# EasyEDA Pro project HandyPico.epro, schematic Schematic1
Board Name: Board1; Create Date: 2025-08-05; Page Name: Main; Project Name: HandyPico; Schematic Name: Schematic1; Update Date: 2025-08-15; Company: EasyEDA.com; Page Size: A3; Version: V1.0
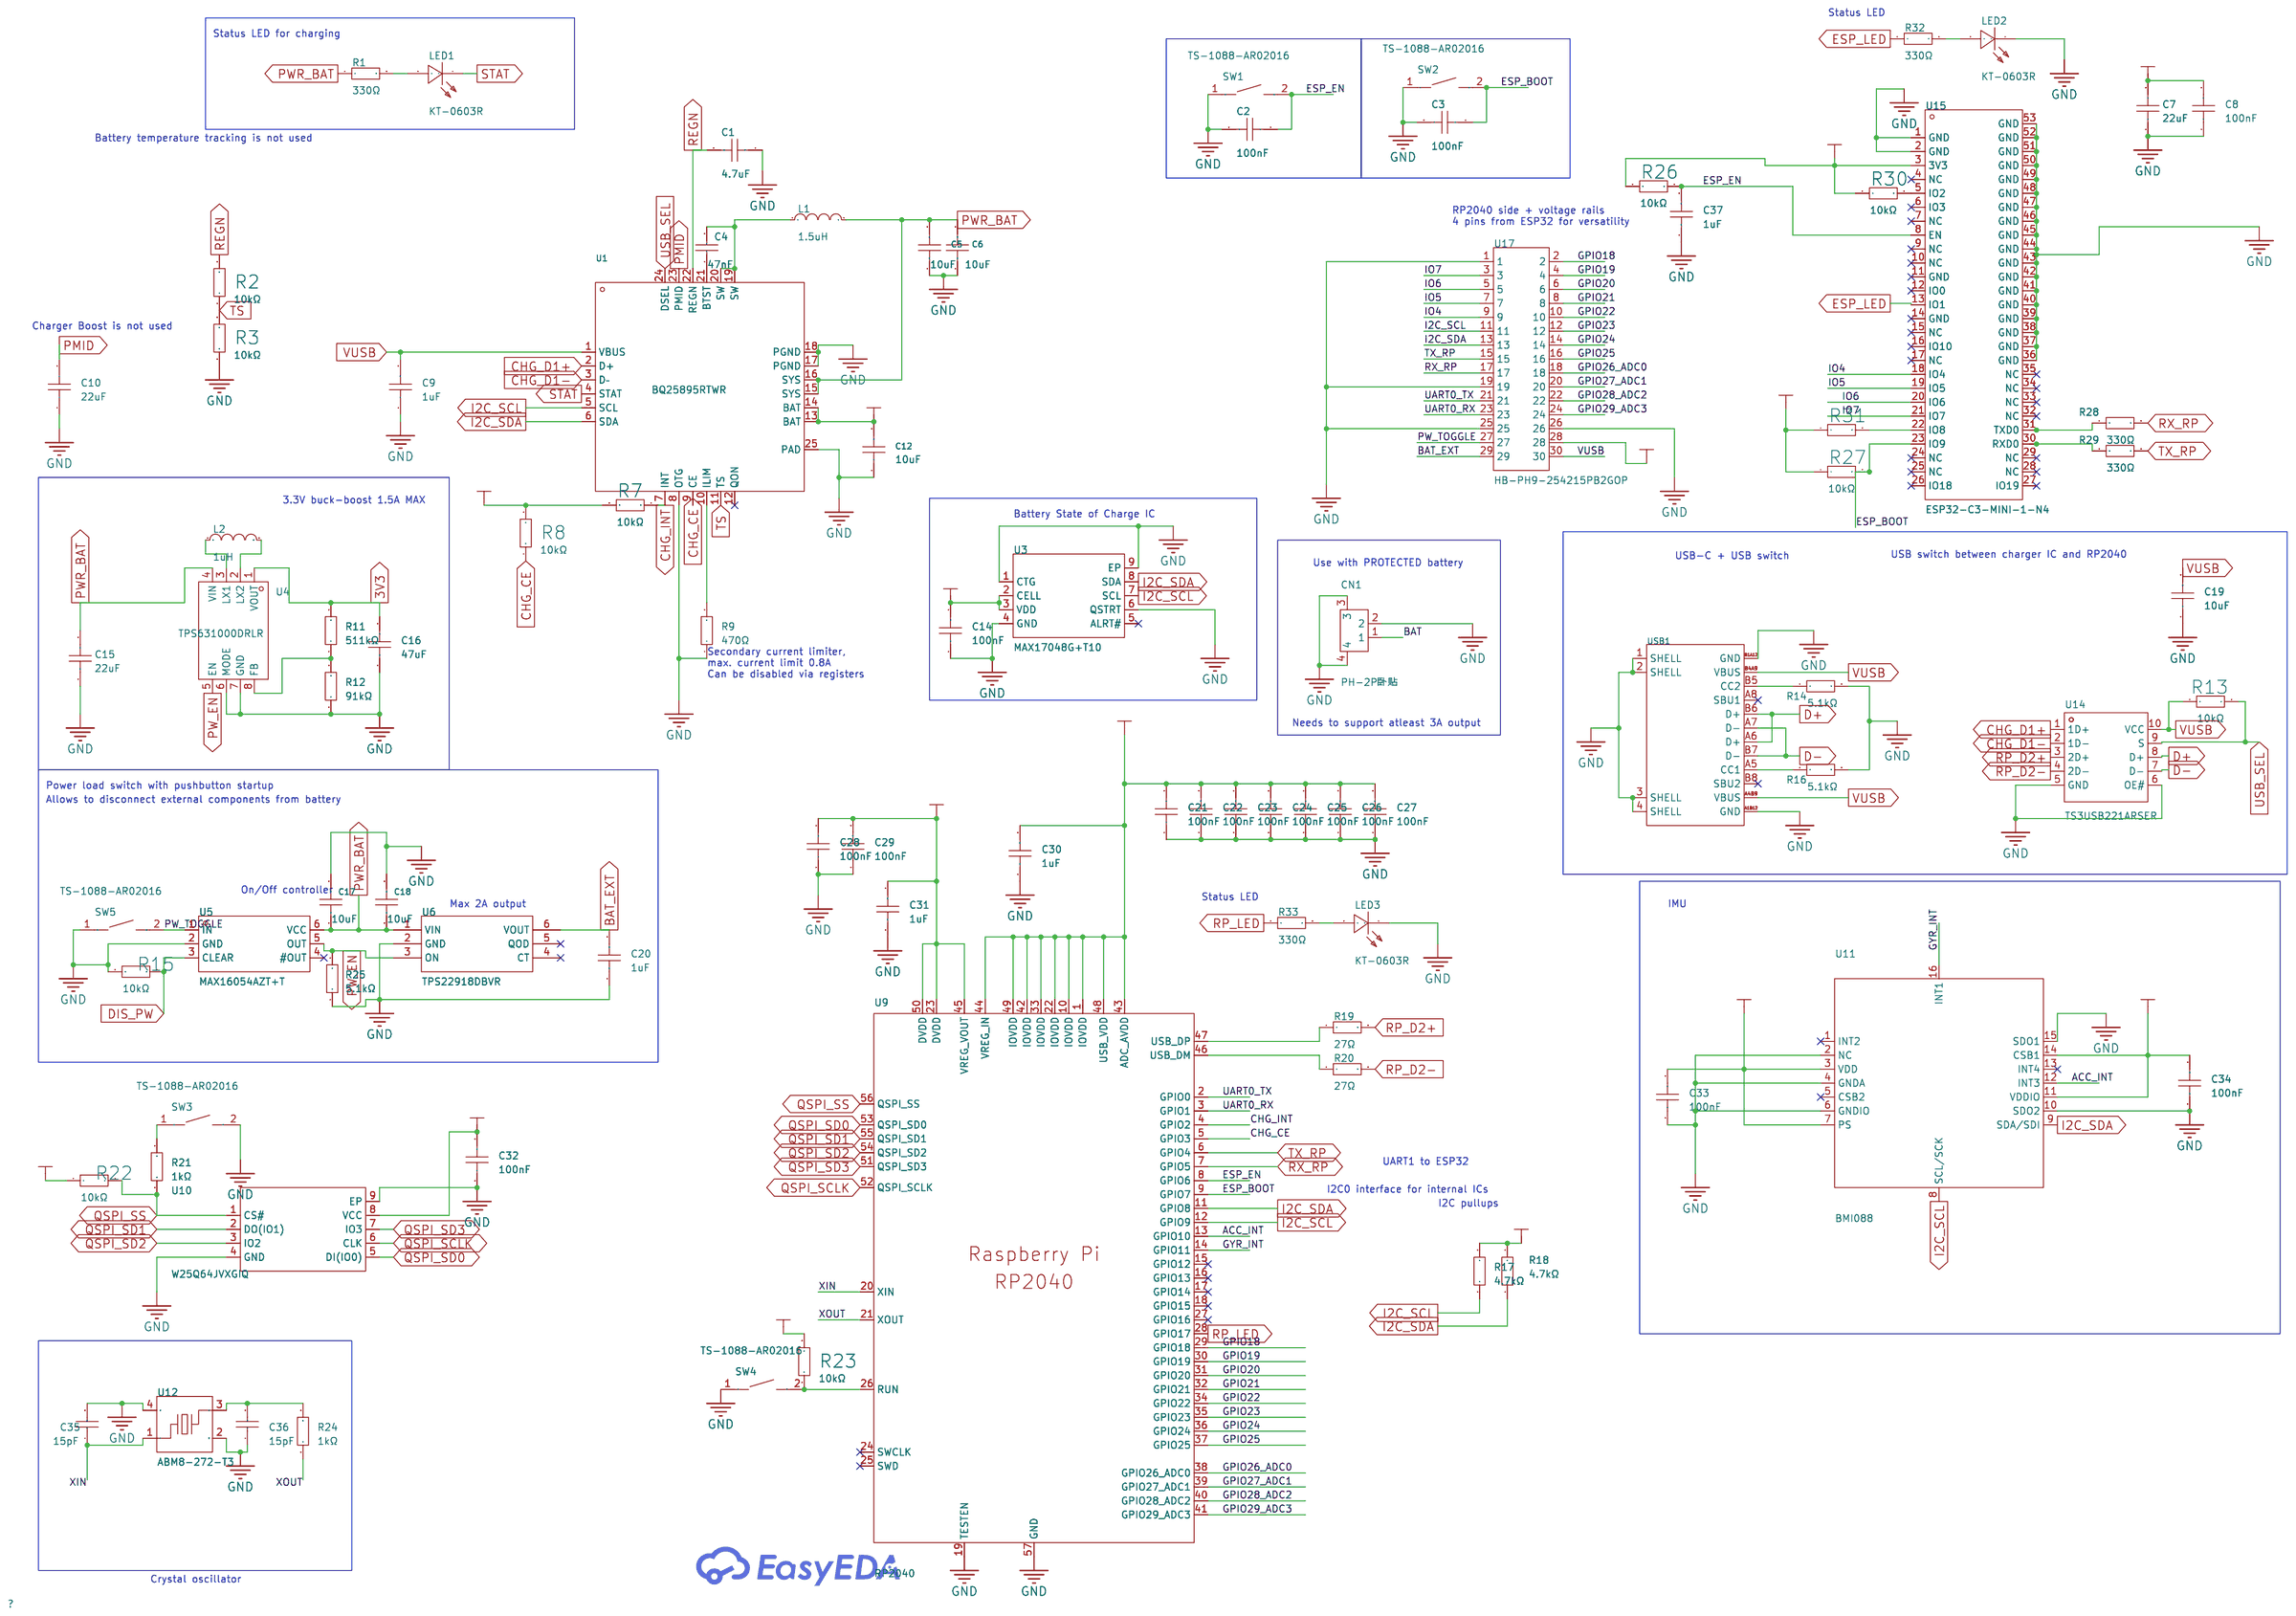
[diagram p0: schematic sheet]

## Parts
C1  4.7uF  [C0402]
C2  100nF  [C0402]
C3  100nF  [C0402]
C4  47nF  [C0603]
C5  10uF  [C0603]
C6  10uF  [C0603]
C7  22uF  [C0603]
C8  100nF  [C0402]
C9  1uF  [C0603]
C10  22uF  [C0603]
C12  10uF  [C0603]
C14  100nF  [C0402]
C15  22uF  [C0603]
C16  47uF  [C0603]
C17  10uF  [C0603]
C18  10uF  [C0603]
C19  10uF  [C0603]
C20  1uF  [C0603]
C21  100nF  [C0402]
C22  100nF  [C0402]
C23  100nF  [C0402]
C24  100nF  [C0402]
C25  100nF  [C0402]
C26  100nF  [C0402]
C27  100nF  [C0402]
C28  100nF  [C0402]
C29  100nF  [C0402]
C30  1uF  [C0402]
C31  1uF  [C0402]
C32  100nF  [C0402]
C33  100nF  [C0402]
C34  100nF  [C0402]
C35  15pF  [C0603]
C36  15pF  [C0603]
C37  1uF  [C0402]
CN1  PH-2P卧贴  [CONN-SMD_2P-P2.00_PH2.0-SPWB]
L1  1.5uH  [IND-SMD_L4.4-W4.2]
L2  1uH  [L1008]
LED1  KT-0603R  [LED0603-RD]
LED2  KT-0603R  [LED0603-RD]
LED3  KT-0603R  [LED0603-RD]
R1  330Ω  [R0402]
R2  10kΩ  [R0402]
R3  10kΩ  [R0402]
R7  10kΩ  [R0402]
R8  10kΩ  [R0402]
R9  470Ω  [R0402]
R11  511kΩ  [R0402]
R12  91kΩ  [R0402]
R13  10kΩ  [R0402]
R14  5.1kΩ  [R0402]
R15  10kΩ  [R0402]
R16  5.1kΩ  [R0402]
R17  4.7kΩ  [R0402]
R18  4.7kΩ  [R0402]
R19  27Ω  [R0603]
R20  27Ω  [R0603]
R21  1kΩ  [R0402]
R22  10kΩ  [R0402]
R23  10kΩ  [R0402]
R24  1kΩ  [R0402]
R25  5.1kΩ  [R0402]
R26  10kΩ  [R0402]
R27  10kΩ  [R0402]
R28  330Ω  [R0402]
R29  330Ω  [R0402]
R30  10kΩ  [R0402]
R31  10kΩ  [R0402]
R32  330Ω  [R0402]
R33  330Ω  [R0402]
SW1  TS-1088-AR02016  [SW-SMD_L3.9-W3.0-P4.45]
SW2  TS-1088-AR02016  [SW-SMD_L3.9-W3.0-P4.45]
SW3  TS-1088-AR02016  [SW-SMD_L3.9-W3.0-P4.45]
SW4  TS-1088-AR02016  [SW-SMD_L3.9-W3.0-P4.45]
SW5  TS-1088-AR02016  [SW-SMD_L3.9-W3.0-P4.45]
U1  BQ25895RTWR  [QFN-24_L4.0-W4.0-P0.50-TL-EP2.7]
U3  MAX17048G+T10  [TDFN-8_L2.0-W2.0-P0.50-BL-EP1.2]
U4  TPS631000DRLR  [SOT-583-8_L2.1-W1.2-P0.50-LS1.6-BL]
U5  MAX16054AZT+T  [TSOT-23-6_L2.9-W1.6-P0.95-LS2.8-TL]
U6  TPS22918DBVR  [SOT-23-6_L2.9-W1.6-P0.95-LS2.8-BR]
U9  RP2040  [LQFN-56_L7.0-W7.0-P0.4-EP]
U10  W25Q64JVXGIQ  [XSON-8_L4.0-W4.0-P0.80-TL-EP]
U11  BMI088  [LGA-16_L4.5-W3.0-P0.50-BL]
U12  ABM8-272-T3  [CRYSTAL-SMD_4P-L3.2-W2.5-BL]
U14  TS3USB221ARSER  [UQFN-10_L2.0-W1.5-P0.50-BL]
U15  ESP32-C3-MINI-1-N4  [WIFIM-SMD_ESP32-C3-MINI-1]
U17  HB-PH9-254215PB2GOP  [HDR-SMD_30P-P2.54-V-M-R2-C15-S7.4]
USB1  HC-TYPE-C-16P-01A-R  [USB-C-SMD_G-SWITCH_GT-USB-7010EN]

## Library data of the parts
C1 = CL05A475MP5NRNC: Capacitance: Tolerance:±20% Tolerance:±20% Voltage Rated: Temperature Coefficient:; LCSC Part Name: 4.7uF ±20% 10V; Supplier Part: C23733; Manufacturer: SAMSUNG(三星); Supplier Footprint: 0402; JLCPCB Part Class: Basic Part; Datasheet: https://atta.szlcsc.com/upload/public/pdf/source/20160218/1457707763339.pdf; Supplier: LCSC; Tolerance: ±20%
C2 C3 C8 C14 C21-C29 C32-C34 = CL05B104KO5NNNC: Capacitance: Tolerance:±10% Tolerance:±10% Voltage Rated: Temperature Coefficient:; LCSC Part Name: 100nF ±10% 16V; Supplier Part: C1525; Manufacturer: SAMSUNG(三星); Supplier Footprint: 0402; JLCPCB Part Class: Basic Part; Datasheet: https://atta.szlcsc.com/upload/public/pdf/source/20160218/1457707763339.pdf; Supplier: LCSC; Tolerance: ±10%
C4 = CL10B473KB8NNNC: Capacitance: Tolerance:±10% Tolerance:±10% Voltage Rated: Temperature Coefficient:; LCSC Part Name: 47nF ±10% 50V; Supplier Part: C1622; Manufacturer: SAMSUNG(三星); Supplier Footprint: 0603; JLCPCB Part Class: Basic Part; Datasheet: https://atta.szlcsc.com/upload/public/pdf/source/20160218/1457707763339.pdf; Supplier: LCSC; Tolerance: ±10%
C5 C6 C12 C17 C18 = CL10A106MA8NRNC: Capacitance: Tolerance:±20% Tolerance:±20% Voltage Rated: Temperature Coefficient:; LCSC Part Name: 10uF ±20% 25V; Supplier Part: C96446; Manufacturer: SAMSUNG(三星); Supplier Footprint: 0603; JLCPCB Part Class: Basic Part; Datasheet: https://atta.szlcsc.com/upload/public/pdf/source/20160218/1457707763339.pdf; Supplier: LCSC; Tolerance: ±20%
C7 C15 = GRM187R61A226ME15D: Capacitance: Tolerance:±20% Tolerance:±20% Voltage Rated: Temperature Coefficient:; LCSC Part Name: 22uF ±20% 10V; Supplier Part: C361061; Manufacturer: muRata(村田); Supplier Footprint: 0603; JLCPCB Part Class: Extended Part; Datasheet: https://atta.szlcsc.com/upload/public/pdf/source/20230811/0F3D1898722F297D9C38FFBA21B94C23.pdf; Supplier: LCSC; Tolerance: ±20%
C9 C20 = CL10A105KB8NNNC: Capacitance: Tolerance:±10% Tolerance:±10% Voltage Rated: Temperature Coefficient:; LCSC Part Name: 1uF ±10% 50V; Supplier Part: C15849; Manufacturer: SAMSUNG(三星); Supplier Footprint: 0603; JLCPCB Part Class: Basic Part; Datasheet: https://atta.szlcsc.com/upload/public/pdf/source/20160218/1457707763339.pdf; Supplier: LCSC; Tolerance: ±10%
C10 = CL10A226MQ8NRNC: Capacitance: Tolerance:±20% Tolerance:±20% Voltage Rated: Temperature Coefficient:; LCSC Part Name: 22uF ±20% 6.3V; Supplier Part: C59461; Manufacturer: SAMSUNG(三星); Supplier Footprint: 0603; JLCPCB Part Class: Basic Part; Datasheet: https://atta.szlcsc.com/upload/public/pdf/source/20160218/1457707763339.pdf; Supplier: LCSC; Tolerance: ±20%
C16 = CL10A476MQ8QRNC: Capacitance: Tolerance:±20% Tolerance:±20% Voltage Rated: Temperature Coefficient:; LCSC Part Name: 47uF ±20% 6.3V; Supplier Part: C730416; Manufacturer: SAMSUNG(三星); Supplier Footprint: 0603; JLCPCB Part Class: Extended Part; Datasheet: https://atta.szlcsc.com/upload/public/pdf/source/20160218/1457707763339.pdf; Supplier: LCSC; Tolerance: ±20%
C19 = CL10A106KP8NNNC: Capacitance: Tolerance:±10% Tolerance:±10% Voltage Rated: Temperature Coefficient:; LCSC Part Name: 10uF ±10% 10V; Supplier Part: C19702; Manufacturer: SAMSUNG(三星); Supplier Footprint: 0603; JLCPCB Part Class: Basic Part; Datasheet: https://atta.szlcsc.com/upload/public/pdf/source/20160218/1457707763339.pdf; Supplier: LCSC; Tolerance: ±10%
C30 C31 C37 = CL05A105KA5NQNC: Capacitance:1uF Tolerance:±10% Tolerance:±10% Voltage Rating:25V Temperature Coefficient:X5R; LCSC Part Name: 1uF ±10% 25V; Supplier Part: C52923; Manufacturer: SAMSUNG(三星); Supplier Footprint: 0402; JLCPCB Part Class: Basic Part; Datasheet: https://item.szlcsc.com/datasheet/CL05A105KA5NQNC/53938.html; Supplier: LCSC; Tolerance: ±10%; Voltage Rating: 25V; Temperature Coefficient: X5R
C35 C36 = CL10C150JB8NNNC: Capacitance: Tolerance:±5% Tolerance:±5% Voltage Rated: Temperature Coefficient:; LCSC Part Name: 15pF ±5% 50V; Supplier Part: C1644; Manufacturer: SAMSUNG(三星); Supplier Footprint: 0603; JLCPCB Part Class: Basic Part; Datasheet: https://atta.szlcsc.com/upload/public/pdf/source/20160218/1457707763339.pdf; Supplier: LCSC; Tolerance: ±5%
CN1 = PH-2P卧贴: Pins Structure:1x2P Pitch:2mm Mounting Type:Horizontal attachment Reference Series:PH Number of Pins:2P Number of Rows:1 Number of PINs Per Row:2 Row Spacing:- Current Rating:- Contact Material:- Contact Plating:- Operating Temperature:- Operating Tempera; LCSC Part Name: 1x2P 间距:2mm 卧贴 系列:PH; Supplier Part: C47647; Manufacturer: BOOMELE(博穆精密); Supplier Footprint: SMD,P=2mm; JLCPCB Part Class: Extended Part; Datasheet: https://atta.szlcsc.com/upload/public/pdf/source/20190102/C47647_9D4529A62A880BCB90F7648666ABEA31.pdf; Supplier: LCSC; Pins Structure: 1x2P; Pitch: 2mm; Mounting Type: Horizontal attachment; Reference Series: PH; Number of Pins: 2P; Number of Rows: 1; Number of PINs Per Row: 2
L1 = FXL0420-1R5-M: Inductance: Tolerance:±20% Tolerance:±20% Rated Current: Saturation Current (Isat):6A DC Resistance (DCR): Type:Integrated molded inductor; LCSC Part Name: 1.5uH ±20% 6A; Supplier Part: C167205; Manufacturer: cjiang(长江微电); Supplier Footprint: SMD,4.2x4.4mm; JLCPCB Part Class: Extended Part; Datasheet: https://atta.szlcsc.com/upload/public/pdf/source/20240426/3189EA8206330E2108542F9E34E540E7.pdf; Supplier: LCSC; Tolerance: ±20%; Saturation Current (Isat): 6A; Type: Integrated molded inductor
L2 = DFE252012P-1R0M=P2: Inductance:1uH Tolerance:±20% Tolerance:±20% Current Rating:4.3A Current - Saturation(Isat):4.3A DC Resistance(DCR):42mΩ Type:- Ratings:-; LCSC Part Name: 1uH ±20% 4.3A; Supplier Part: C882955; Manufacturer: muRata(村田); Supplier Footprint: 1008; JLCPCB Part Class: Extended Part; Datasheet: https://atta.szlcsc.com/upload/public/pdf/source/20201020/C882955_448D34C20C76D68776F8F2692B40A653.pdf; Supplier: LCSC; Tolerance: ±20%; Current Rating: 4.3A; Current - Saturation(Isat): 4.3A; DC Resistance(DCR): 42mΩ
LED1-LED3 = KT-0603R: Emitted Color:Red Power Dissipation:- Forward Current:- Dominant Wavelength:- Dominant Wavelength:- Peak Wavelength:- Diode Configuration:- Lens Color:- Color Temperature:- Color Temperature:- Viewing Angle:- Mounting Sytle:- Operating Temperature:-40℃~+8; LCSC Part Name: 0603 红灯 高亮; Supplier Part: C2286; Manufacturer: KENTO; Supplier Footprint: 0603; JLCPCB Part Class: Basic Part; Datasheet: https://atta.szlcsc.com/upload/public/pdf/source/20160616/1466072038404.pdf; Supplier: LCSC; Emitted Color: Red; Operating Temperature: -40℃~+85℃
R1 R32 R33 = 0402WGF3300TCE: Type:Thick Film Resistors Resistance:330Ω Tolerance:±1% Tolerance:±1% Power(Watts):1/16W Voltage-Supply(Max):50V Temperature Coefficient:±100ppm/℃ Temperature Coefficient:±100ppm/℃ Operating Temperature:-55℃~+155℃ Operating Temperature:-55℃~+155℃; LCSC Part Name: 330Ω ±1% 62.5mW 厚膜电阻; Supplier Part: C25104; Manufacturer: UNI-ROYAL(厚声); Supplier Footprint: 0402; JLCPCB Part Class: Basic Part; Datasheet: https://item.szlcsc.com/datasheet/0402WGF3300TCE/25847.html; Supplier: LCSC; Type: Thick Film Resistors; Tolerance: ±1%; Power(Watts): 1/16W; Voltage-Supply(Max): 50V; Temperature Coefficient: ±100ppm/℃; Operating Temperature: -55℃~+155℃
R2 R3 R7 R8 R13 R15 R22 R23 R26 R27 R30 R31 = 0402WGF1002TCE: Type:Thick Film Resistors Resistance:10kΩ Tolerance:±1% Tolerance:±1% Power(Watts): Overload Voltage (Max): Temperature Coefficient:±100ppm/℃ Temperature Coefficient:±100ppm/℃ Operating Temperature Range:-55℃~+155℃ Operating Temperature Range:-55℃~+155℃; LCSC Part Name: 10kΩ ±1% 62.5mW 厚膜电阻; Supplier Part: C25744; Manufacturer: UNI-ROYAL(厚声); Supplier Footprint: 0402; JLCPCB Part Class: Basic Part; Datasheet: https://atta.szlcsc.com/upload/public/pdf/source/20200306/C422600_1E6D84923E4A46A82E41ADD87F860B5C.pdf; Supplier: LCSC; Type: Thick Film Resistors; Tolerance: ±1%; Temperature Coefficient: ±100ppm/℃; Operating Temperature Range: -55℃~+155℃
R9 = 0402WGF4700TCE: Type:Thick Film Resistors Resistance: Tolerance:±1% Tolerance:±1% Power(Watts): Overload Voltage (Max): Temperature Coefficient:±100ppm/℃ Temperature Coefficient:±100ppm/℃ Operating Temperature Range:-55℃~+155℃ Operating Temperature Range:-55℃~+155℃; LCSC Part Name: 470Ω ±1% 62.5mW 厚膜电阻; Supplier Part: C25117; Manufacturer: UNI-ROYAL(厚声); Supplier Footprint: 0402; JLCPCB Part Class: Basic Part; Datasheet: https://atta.szlcsc.com/upload/public/pdf/source/20200306/C422600_1E6D84923E4A46A82E41ADD87F860B5C.pdf; Supplier: LCSC; Type: Thick Film Resistors; Tolerance: ±1%; Temperature Coefficient: ±100ppm/℃; Operating Temperature Range: -55℃~+155℃
R11 = 0402WGF5113TCE: Type:Thick Film Resistor Resistance:511kΩ Tolerance:±1% Tolerance:±1% Power(Watts):62.5mW Voltage-Supply(Max):50V Temperature Coefficient:±100ppm/℃ Temperature Coefficient:±100ppm/℃ Operating Temperature:-55℃~+155℃ Operating Temperature:-55℃~+155℃; LCSC Part Name: 511kΩ ±1% 62.5mW 厚膜电阻; Supplier Part: C64042; Manufacturer: UNI-ROYAL(厚声); Supplier Footprint: 0402; JLCPCB Part Class: Extended Part; Datasheet: https://atta.szlcsc.com/upload/public/pdf/source/20200306/C422600_1E6D84923E4A46A82E41ADD87F860B5C.pdf; Supplier: LCSC; Type: Thick Film Resistor; Tolerance: ±1%; Power(Watts): 62.5mW; Voltage-Supply(Max): 50V; Temperature Coefficient: ±100ppm/℃; Operating Temperature: -55℃~+155℃
R12 = 0402WGF9102TCE: Type:Thick Film Resistors Resistance:91kΩ Tolerance:±1% Tolerance:±1% Power(Watts): Overload Voltage (Max): Temperature Coefficient:±100ppm/℃ Temperature Coefficient:±100ppm/℃ Operating Temperature Range:-55℃~+155℃ Operating Temperature Range:-55℃~+155℃; LCSC Part Name: 91kΩ ±1% 62.5mW 厚膜电阻; Supplier Part: C4147; Manufacturer: UNI-ROYAL(厚声); Supplier Footprint: 0402; JLCPCB Part Class: Extended Part; Datasheet: https://atta.szlcsc.com/upload/public/pdf/source/20200306/C422600_1E6D84923E4A46A82E41ADD87F860B5C.pdf; Supplier: LCSC; Type: Thick Film Resistors; Tolerance: ±1%; Temperature Coefficient: ±100ppm/℃; Operating Temperature Range: -55℃~+155℃
R14 R16 R25 = 0402WGF5101TCE: Type:Thick Film Resistor Resistance:5.1kΩ Tolerance:±1% Tolerance:±1% Power(Watts):62.5mW Voltage-Supply(Max):50V Temperature Coefficient:±100ppm/℃ Temperature Coefficient:±100ppm/℃ Operating Temperature:-55℃~+155℃ Operating Temperature:-55℃~+155℃; LCSC Part Name: 5.1kΩ ±1% 62.5mW 厚膜电阻; Supplier Part: C25905; Manufacturer: UNI-ROYAL(厚声); Supplier Footprint: 0402; JLCPCB Part Class: Basic Part; Datasheet: https://atta.szlcsc.com/upload/public/pdf/source/20200306/C422600_1E6D84923E4A46A82E41ADD87F860B5C.pdf; Supplier: LCSC; Type: Thick Film Resistor; Tolerance: ±1%; Power(Watts): 62.5mW; Voltage-Supply(Max): 50V; Temperature Coefficient: ±100ppm/℃; Operating Temperature: -55℃~+155℃
R17 R18 = 0402WGF4701TCE: Type:Thick Film Resistors Resistance:4.7kΩ Tolerance:±1% Tolerance:±1% Power(Watts): Overload Voltage (Max): Temperature Coefficient:±100ppm/℃ Temperature Coefficient:±100ppm/℃ Operating Temperature Range:-55℃~+155℃ Operating Temperature Range:-55℃~+155℃; LCSC Part Name: 4.7kΩ ±1% 62.5mW 厚膜电阻; Supplier Part: C25900; Manufacturer: UNI-ROYAL(厚声); Supplier Footprint: 0402; JLCPCB Part Class: Basic Part; Datasheet: https://atta.szlcsc.com/upload/public/pdf/source/20200306/C422600_1E6D84923E4A46A82E41ADD87F860B5C.pdf; Supplier: LCSC; Type: Thick Film Resistors; Tolerance: ±1%; Temperature Coefficient: ±100ppm/℃; Operating Temperature Range: -55℃~+155℃
R19 R20 = 0603WAF270JT5E: Type:Thick Film Resistors Resistance:27Ω Tolerance:±1% Tolerance:±1% Power(Watts): Overload Voltage (Max): Temperature Coefficient:±200ppm/℃ Temperature Coefficient:±200ppm/℃ Operating Temperature Range:-55℃~+155℃ Operating Temperature Range:-55℃~+155℃; LCSC Part Name: 27Ω ±1% 100mW 厚膜电阻; Supplier Part: C25190; Manufacturer: UNI-ROYAL(厚声); Supplier Footprint: 0603; JLCPCB Part Class: Extended Part; Datasheet: https://atta.szlcsc.com/upload/public/pdf/source/20200306/C422600_1E6D84923E4A46A82E41ADD87F860B5C.pdf; Supplier: LCSC; Type: Thick Film Resistors; Tolerance: ±1%; Temperature Coefficient: ±200ppm/℃; Operating Temperature Range: -55℃~+155℃
R21 R24 = 0402WGF1001TCE: Type:Thick Film Resistors Resistance:1kΩ Tolerance:±1% Tolerance:±1% Power(Watts): Overload Voltage (Max): Temperature Coefficient:±100ppm/℃ Temperature Coefficient:±100ppm/℃ Operating Temperature Range:-55℃~+155℃ Operating Temperature Range:-55℃~+155℃; LCSC Part Name: 1kΩ ±1% 62.5mW 厚膜电阻; Supplier Part: C11702; Manufacturer: UNI-ROYAL(厚声); Supplier Footprint: 0402; JLCPCB Part Class: Basic Part; Datasheet: https://atta.szlcsc.com/upload/public/pdf/source/20200306/C422600_1E6D84923E4A46A82E41ADD87F860B5C.pdf; Supplier: LCSC; Type: Thick Film Resistors; Tolerance: ±1%; Temperature Coefficient: ±100ppm/℃; Operating Temperature Range: -55℃~+155℃
R28 R29 = 0402WGF3300TCE: Type:Thick Film Resistors Resistance:330Ω Tolerance:±1% Tolerance:±1% Power(Watts):1/16W Voltage-Supply(Max):50V Temperature Coefficient:±100ppm/℃ Temperature Coefficient:±100ppm/℃ Operating Temperature:-55℃~+155℃ Operating Temperature:-55℃~+155℃; LCSC Part Name: 330Ω ±1% 62.5mW 厚膜电阻; Supplier Part: C25104; Manufacturer: UNI-ROYAL(厚声); Supplier Footprint: 0402; JLCPCB Part Class: Basic Part; Datasheet: https://atta.szlcsc.com/upload/public/pdf/source/20200306/C422600_1E6D84923E4A46A82E41ADD87F860B5C.pdf; Supplier: LCSC; Type: Thick Film Resistors; Tolerance: ±1%; Power(Watts): 1/16W; Voltage-Supply(Max): 50V; Temperature Coefficient: ±100ppm/℃; Operating Temperature: -55℃~+155℃
SW1-SW5 = TS-1088-AR02016: Circuit:SPST Actuator Style:Round Button Operating Force:160gf Mounting Style:Brick nogging Switch Length:4mm Switch Width:3mm Switch Height:2mm Strike Gundam:不带 Contact Current:50mA Voltage Rating (DC):12V Insulation Resistance:100MΩ Actuator/Cap Color:B; LCSC Part Name: 4*3*2mm 立贴 轻触开关; Supplier Part: C720477; Manufacturer: XUNPU(讯普); Supplier Footprint: SMD; JLCPCB Part Class: Basic Part; Datasheet: https://atta.szlcsc.com/upload/public/pdf/source/20200810/C720475_60D09DD6C54279ADDB2DC25100F1CC11.pdf; Supplier: LCSC; Circuit: SPST; Actuator Style: Round Button; Operating Force: 160gf; Mounting Style: Brick nogging; Switch Length: 4mm; Switch Width: 3mm; Switch Height: 2mm; Strike Gundam: 不带; Contact Current: 50mA; Voltage Rating (DC): 12V; Insulation Resistance: 100MΩ; Actuator/Cap Color: Black; Pin Style: SMDSplicing; Mechanical Life: 10万次; Operating Temperature: -30℃~+80℃
U1 = BQ25895RTWR: Supplier Part: C80200; Manufacturer: TI(德州仪器); Supplier Footprint: QFN-24-EP(4x4); JLCPCB Part Class: Extended Part; Datasheet: https://www.ti.com/cn/lit/gpn/bq25895; Supplier: LCSC
U3 = MAX17048G+T10: The Chip Type:Battery monitoring chip Voltage - Supply:2.5V~4.5V Voltage - Supply:2.5V~4.5V Type of Battery:Lithium-ion/Polymer Number of Cells:1 Number of Cells:1 Operating Temperature:-40℃~+85℃ Operating Temperature:-40℃~+85℃; LCSC Part Name: 单节/双节电池电量计使用ModelGauge技术; Supplier Part: C2682616; Manufacturer: ADI(亚德诺)/MAXIM(美信); Supplier Footprint: DFN-8-EP(2x2); JLCPCB Part Class: Extended Part; Datasheet: https://atta.szlcsc.com/upload/public/pdf/source/20210106/C2682616_818568B5D3BA4B627110FCAA33E0BFB1.pdf; Supplier: LCSC; The Chip Type: Battery monitoring chip; Voltage - Supply: 2.5V~4.5V; Type of Battery: Lithium-ion/Polymer; Number of Cells: 1; Operating Temperature: -40℃~+85℃
U4 = TPS631000DRLR: Input Voltage:1.6V~5.5V Input Voltage:1.6V~5.5V Output Voltage:1.2V~5.3V Output Voltage:1.2V~5.3V Output Current (Max):2A Switching Frequency:2.2MHz Operating Temperature:-40℃~+125℃ Operating Temperature:-40℃~+125℃ Topology:Step-down-Boost Quiescent Curre; Supplier Part: C5219190; Manufacturer: TI(德州仪器); Supplier Footprint: SOT-583; JLCPCB Part Class: Extended Part; Datasheet: https://www.ti.com/cn/lit/gpn/tps631000; Supplier: LCSC; Input Voltage: 1.6V~5.5V; Output Voltage: 1.2V~5.3V; Output Current (Max): 2A; Switching Frequency: 2.2MHz; Operating Temperature: -40℃~+125℃; Topology: Step-down-Boost; Quiescent Current (Iq): 8uA; Switch tube (built-in/external): Built-in
U5 = MAX16054AZT+T: Voltage - Supply:2.7V~5.5V Voltage - Supply:2.7V~5.5V Operating Temperature:-40℃~+125℃ Operating Temperature:-40℃~+125℃; LCSC Part Name: 带去抖动和±15kV ESD保护的开/关控制器; Supplier Part: C79401; Manufacturer: ADI(亚德诺); Supplier Footprint: TSOT-23-6; JLCPCB Part Class: Extended Part; Datasheet: https://atta.szlcsc.com/upload/public/pdf/source/20171230/C79401_15146281019061222139.pdf; Supplier: LCSC; Voltage - Supply: 2.7V~5.5V; Operating Temperature: -40℃~+125℃
U6 = TPS22918DBVR: Type:Load Switch Number of Channels:1 Control Input Logic:Active High Maximum Continuous Current:2A Voltage - Supply:1V~5.5V Voltage - Supply:1V~5.5V RDS(on):53mΩ Operating Temperature-:-40℃~+105℃ Operating Temperature-:-40℃~+105℃; LCSC Part Name: 5.5V 2A 导通电阻为52mΩ的负载开关; Supplier Part: C131941; Manufacturer: TI(德州仪器); Supplier Footprint: SOT-23-6; JLCPCB Part Class: Extended Part; Datasheet: https://www.ti.com/cn/lit/gpn/tps22918; Supplier: LCSC; Type: Load Switch; Number of Channels: 1; Control Input Logic: Active High; Maximum Continuous Current: 2A; Voltage - Supply: 1V~5.5V; RDS(on): 53mΩ; Operating Temperature	-: -40℃~+105℃
U9 = RP2040_C2040: CPU Core:- CPU Maximum Speed:133MHz Number of I/O:30 ADC (Bit):12bit Applications:-; LCSC Part Name: RP2040（RP2B2）; Supplier Part: C2040; Manufacturer: Raspberry Pi(树莓派); Supplier Footprint: LQFN-56(7x7); JLCPCB Part Class: Extended Part; Datasheet: https://atta.szlcsc.com/upload/public/pdf/source/20210621/C2040_96F425825606B7957D87DD32E2512CA9.pdf; Supplier: LCSC; CPU Maximum Speed: 133MHz; Number of I/O: 30; ADC (Bit): 12bit
U10 = W25Q64JVXGIQ: Interface:SPI Memory Size:64Mbit Clock Frequency:133MHz Voltage - Supply:2.7V~3.6V Voltage - Supply:2.7V~3.6V Program / Erase Cycles:100,000 Cycles Page Programming Time (Tpp):3ms Data Retention - TDR (Year):20 Years; Supplier Part: C2940195; Manufacturer: Winbond(华邦); Supplier Footprint: XSON-8-EP(4x4); JLCPCB Part Class: Extended Part; Datasheet: https://atta.szlcsc.com/upload/public/pdf/source/20220111/96C134BA110DAC08742B3CB6C4519B4C.pdf; Supplier: LCSC; Interface: SPI; Memory Size: 64Mbit; Clock Frequency: 133MHz; Voltage - Supply: 2.7V~3.6V; Program / Erase Cycles: 100,000 Cycles; Page Programming Time (Tpp): 3ms; Data Retention - TDR (Year): 20 Years
U11 = BMI088: Sensor Type:加速度计陀螺仪 Operating Temperature:-40℃~+85℃ Operating Temperature:-40℃~+85℃; Supplier Part: C194919; Manufacturer: Bosch(博世); Supplier Footprint: LGA-16(3x4.5); JLCPCB Part Class: Extended Part; Datasheet: https://atta.szlcsc.com/upload/public/pdf/source/20180628/C194919_66CCF125FF968C218A4D358C68AC68D6.pdf; Supplier: LCSC; Sensor Type: 加速度计陀螺仪; Operating Temperature: -40℃~+85℃
U12 = ABM8-272-T3_C20625731: Supplier Part: C20625731; Manufacturer: ABRACON; Supplier Footprint: SMD3225-4P; JLCPCB Part Class: Extended Part; Datasheet: https://atta.szlcsc.com/upload/public/pdf/source/20240227/A8BE43F636D80F75C9AF5C59EDF21E9A.pdf; Supplier: LCSC
U14 = TS3USB221ARSER: Switch Circuit:SPDT(SPDT) -3dB Bandwidth:900MHz Voltage - Supply:2.5V~3.3V Voltage - Supply:2.5V~3.3V RDS(on):6Ω Operating Temperature:-40℃~+85℃ Operating Temperature:-40℃~+85℃; LCSC Part Name: TS3USB221A ESD保护、高速USB2.0 (480-Mbps) 1:2多路复用器和解复用器开关，带单使能; Supplier Part: C128396; Manufacturer: TI(德州仪器); Supplier Footprint: UQFN-10(1.5x2); JLCPCB Part Class: Extended Part; Datasheet: https://www.ti.com/cn/lit/gpn/ts3usb221a; Supplier: LCSC; Switch Circuit: SPDT(SPDT); -3dB Bandwidth: 900MHz; Voltage - Supply: 2.5V~3.3V; RDS(on): 6Ω; Operating Temperature: -40℃~+85℃
U15 = ESP32-C3-MINI-1-N4: Supplier Part: C2838502; Manufacturer: ESPRESSIF(乐鑫); Supplier Footprint: SMD,13.2x16.6mm; JLCPCB Part Class: Extended Part; Datasheet: https://item.szlcsc.com/datasheet/ESP32-C3-MINI-1-N4/3013227.html; Supplier: LCSC
U17 = HB-PH9-254215PB2GOP: Pin Structure:2x15P Pitch:2.54mm Row Spacing:2.54mm Circluar Pins/Square Pins:Policy Number of Rows:Double Row Number of Pins:30P Current Rating:3A Voltage Rating (Max):250V Length of Mating Pin:6mm Insulation Height:2.54mm Contact Material:Brass Contact; LCSC Part Name: 2x15P 间距:2.54mm 方针; Supplier Part: C6332240; Manufacturer: HANBO(汉博); Supplier Footprint: SMD,P=2.54mm; JLCPCB Part Class: Extended Part; Datasheet: https://atta.szlcsc.com/upload/public/pdf/source/20230512/A7502FD1B425DE86D659847ECB20131C.pdf; Supplier: LCSC; Pin Structure: 2x15P; Pitch: 2.54mm; Row Spacing: 2.54mm; Circluar Pins/Square Pins: Policy; Number of Rows: Double Row; Number of Pins: 30P; Current Rating: 3A; Voltage Rating (Max): 250V; Length of Mating Pin: 6mm; Insulation Height: 2.54mm; Contact Material: Brass; Contact Plating: Gold; Operating Temperature: -40℃~+105℃; Color: Black
USB1 = HC-TYPE-C-16P-01A-R: Connector Type:Type-C Standard:USB 3.1 Gender:Female Number of Ports:1 Number of Contacts:16P Mounting Style:卧贴 Current Rating - Power (Max):3A Contact Material:高导铜 Contact Plating:Gold Operating Temperature Range:-25℃~+85℃ Operating Temperature Range:-25; LCSC Part Name: Type-C 母 卧贴; Supplier Part: C2997433; Manufacturer: HCTL(华灿天禄); Supplier Footprint: SMD; JLCPCB Part Class: Extended Part; Datasheet: https://atta.szlcsc.com/upload/public/pdf/source/20221116/498852B5DEA0D56366DE251CB8E386B1.pdf; Supplier: LCSC; Connector Type: Type-C; Standard: USB 3.1; Gender: Female; Number of Ports: 1; Number of Contacts: 16P; Mounting Style: 卧贴; Current Rating - Power (Max): 3A; Contact Material: 高导铜; Contact Plating: Gold; Operating Temperature Range: -25℃~+85℃; Soldering Temperature(Max): 260℃

## Nets
1V1: C28.2 C29.2 C31.2 U9.23(DVDD) U9.45(VREG_VOUT) U9.50(DVDD)
3V3: C7.2 C8.2 C16.2 C21.2 C22.2 C23.2 C24.2 C25.2 C26.2 C27.2 C30.2 C32.2 C33.2 C34.2 R7.2 R8.2 R11.2 R17.2 R18.2 R22.1 R23.2 R26.2 R27.1 R30.1 R31.1 U4.1(VOUT) U9.1(IOVDD) U9.10(IOVDD) U9.22(IOVDD) U9.33(IOVDD) U9.42(IOVDD) U9.43(ADC_AVDD) U9.44(VREG_IN) U9.48(USB_VDD) U9.49(IOVDD) U10.8(VCC) U11.3(VDD) U11.7(PS) U11.11(VDDIO) U11.14(CSB1) U15.3(3V3) U17.28
GND: C1.1 C2.2 C3.2 C5.1 C6.1 C7.1 C8.1 C9.1 C10.1 C12.1 C14.1 C15.1 C16.1 C17.2 C18.2 C19.1 C20.1 C21.1 C22.1 C23.1 C24.1 C25.1 C26.1 C27.1 C28.1 C29.1 C30.1 C31.1 C32.1 C33.1 C34.1 C35.2 C36.1 C37.1 CN1.2 CN1.3 CN1.4 LED2.1(K) LED3.1(K) R3.1 R9.1 R12.1 R14.2 R15.1 R16.2 R25.1 SW1.1 SW2.1 SW3.2 SW4.1 SW5.1 U1.8(OTG) U1.17(PGND) U1.18(PGND) U1.25(PAD) U3.1(CTG) U3.4(GND) U3.6(QSTRT) U3.9(EP) U4.6(MODE) U4.7(GND) U5.2(GND) U6.2(GND) U9.19(TESTEN) U9.57(GND) U10.4(GND) U10.9(EP) U11.2(NC) U11.4(GNDA) U11.6(GNDIO) U11.10(SDO2) U11.15(SDO1) U12.2(GND) U12.4(GND) U14.5(GND) U14.6(OE#) U15.1(GND) U15.2(GND) U15.36(GND) U15.37(GND) U15.38(GND) U15.39(GND) U15.40(GND) U15.41(GND) U15.42(GND) U15.43(GND) U15.44(GND) U15.45(GND) U15.46(GND) U15.47(GND) U15.48(GND) U15.49(GND) U15.50(GND) U15.51(GND) U15.52(GND) U15.53(GND) U17.1 U17.19 U17.25 U17.26 USB1.1(SHELL) USB1.2(SHELL) USB1.3(SHELL) USB1.4(SHELL) USB1.A1B12(GND) USB1.B1A12(GND)
ACC_INT: U9.13(GPIO10) U11.12(INT3)
BAT: C12.2 C14.2 CN1.1 U1.13(BAT) U1.14(BAT) U3.2(CELL) U3.3(VDD)
BAT_EXT: C20.2 U6.6(VOUT) U17.29
CHG_CE: R8.1 U1.9(CE) U9.5(GPIO3)
CHG_D1+: U1.2(D+) U14.1(1D+)
CHG_D1-: U1.3(D–) U14.2(1D-)
CHG_INT: R7.1 U1.7(INT) U9.4(GPIO2)
D+: U14.8(D+) USB1.A6(D+) USB1.B6(D+)
D-: U14.7(D-) USB1.A7(D-) USB1.B7(D-)
DIS_PW: R15.2 U5.3(CLEAR)
ESP_BOOT: C3.1 R27.2 SW2.2 U9.9(GPIO7) U15.23(IO9)
ESP_EN: C2.1 C37.2 R26.1 SW1.2 U9.8(GPIO6) U15.8(EN)
ESP_LED: R32.1 U15.13(IO1)
GPIO18: U9.29(GPIO18) U17.2
GPIO19: U9.30(GPIO19) U17.4
GPIO20: U9.31(GPIO20) U17.6
GPIO21: U9.32(GPIO21) U17.8
GPIO22: U9.34(GPIO22) U17.10
GPIO23: U9.35(GPIO23) U17.12
GPIO24: U9.36(GPIO24) U17.14
GPIO25: U9.37(GPIO25) U17.16
GPIO26_ADC0: U9.38(GPIO26_ADC0) U17.18
GPIO27_ADC1: U9.39(GPIO27_ADC1) U17.20
GPIO28_ADC2: U9.40(GPIO28_ADC2) U17.22
GPIO29_ADC3: U9.41(GPIO29_ADC3) U17.24
GYR_INT: U9.14(GPIO11) U11.16(INT1)
I2C_SCL: R17.1 U1.5(SCL) U3.7(SCL) U9.12(GPIO9) U11.8(SCL/SCK) U17.11
I2C_SDA: R18.1 U1.6(SDA) U3.8(SDA) U9.11(GPIO8) U11.9(SDA/SDI) U17.13
IO4: U15.18(IO4) U17.9
IO5: U15.19(IO5) U17.7
IO6: U15.20(IO6) U17.5
IO7: U15.21(IO7) U17.3
PMID: C10.2 U1.23(PMID)
PW_EN: R25.2 U4.5(EN) U5.5(OUT) U6.3(ON)
PW_TOGGLE: SW5.2 U5.1(IN) U17.27
PWR_BAT: C5.2 C6.2 C15.2 C17.1 C18.1 L1.2 R1.1 U1.15(SYS) U1.16(SYS) U4.4(VIN) U5.6(VCC) U6.1(VIN)
QSPI_SCLK: U9.52(QSPI_SCLK) U10.6(CLK)
QSPI_SD0: U9.53(QSPI_SD0) U10.5(DI(IO0))
QSPI_SD1: U9.55(QSPI_SD1) U10.2(DO(IO1))
QSPI_SD2: U9.54(QSPI_SD2) U10.3(IO2)
QSPI_SD3: U9.51(QSPI_SD3) U10.7(IO3)
QSPI_SS: R21.2 R22.2 U9.56(QSPI_SS) U10.1(CS#)
REGN: C1.2 R2.2 U1.22(REGN)
RP_D2+: R19.2 U14.3(2D+)
RP_D2-: R20.2 U14.4(2D-)
RP_LED: R33.1 U9.28(GPIO17)
RX_RP: R28.2 U9.7(GPIO5) U17.17
STAT: LED1.1(K) U1.4(STAT)
TS: R2.1 R3.2 U1.11(TS)
TX_RP: R29.2 U9.6(GPIO4) U17.15
UART0_RX: U9.3(GPIO1) U17.23
UART0_TX: U9.2(GPIO0) U17.21
USB_SEL: R13.2 U1.24(DSEL) U14.9(S)
VUSB: C9.2 C19.2 R13.1 U1.1(VBUS) U14.10(VCC) U17.30 USB1.A4B9(VBUS) USB1.B4A9(VBUS)
XIN: C35.1 U9.20(XIN) U12.1
XOUT: R24.1 U9.21(XOUT)
$1N1438: C36.2 R24.2 U12.3
$1N3021: R20.1 U9.46(USB_DM)
$1N3026: R19.1 U9.47(USB_DP)
$1N4810: R21.1 SW3.1
$1N5167: R23.1 SW4.2 U9.26(RUN)
$1N11266: C4.2 L1.1 U1.19(SW) U1.20(SW)
$1N11288: C4.1 U1.21(BTST)
$1N11331: R9.2 U1.10(ILIM)
$1N11347: LED1.2(A) R1.2
$1N11360: R11.1 R12.2 U4.8(FB)
$1N11369: L2.1 U4.3(LX1)
$1N11371: L2.2 U4.2(LX2)
$1N13969: R16.1 USB1.A5(CC1)
$1N13971: R14.1 USB1.B5(CC2)
$1N37377: R29.1 U15.30(RXD0)
$1N37378: R28.1 U15.31(TXD0)
$1N37488: R30.2 U15.5(IO2)
$1N37542: R31.2 U15.22(IO8)
$1N43548: LED2.2(A) R32.2
$1N43695: LED3.2(A) R33.2

Not connected (* = marked no-connect by the designer): U1 12(QON)*; U3 5(ALRT#)*; U5 4(#OUT)*; U6 4(CT)* 5(QOD)*; U9 15(GPIO12)* 16(GPIO13)* 17(GPIO14)* 18(GPIO15)* 24(SWCLK)* 25(SWD)* 27(GPIO16)*; U11 1(INT2)* 5(CSB2)* 13(INT4)*; U15 4(NC)* 6(IO3)* 7(NC)* 9(NC)* 10(NC)* 11(GND)* 12(IO0)* 14(GND)* 15(NC)* 16(IO10)* 17(NC)* 24(NC)* 25(NC)* 26(IO18)* 27(IO19)* 28(NC)* 29(NC)* 32(NC)* 33(NC)* 34(NC)* 35(NC)*; USB1 A8(SBU1)* B8(SBU2)*

## Notes on the sheet
- Status LED
- Status LED for charging
- Battery temperature tracking is not used
- RP2040 side + voltage rails
  4 pins from ESP32 for versatility
- Charger Boost is not used
- 3.3V buck-boost 1.5A MAX
- Battery State of Charge IC
- USB-C + USB switch
- USB switch between charger IC and RP2040
- Use with PROTECTED battery
- Secondary current limiter,
  max. current limit 0.8A
  Can be disabled via registers
- Needs to support atleast 3A output
- Power load switch with pushbutton startup
- Allows to disconnect external components from battery
- On/Off controller
- Status LED
- Max 2A output
- IMU
- UART1 to ESP32
- I2C0 interface for internal ICs
- I2C pullups
- Crystal oscillator
